# EAGLE design Modul wykonawczy nastawnika (EAGLE 5.09)
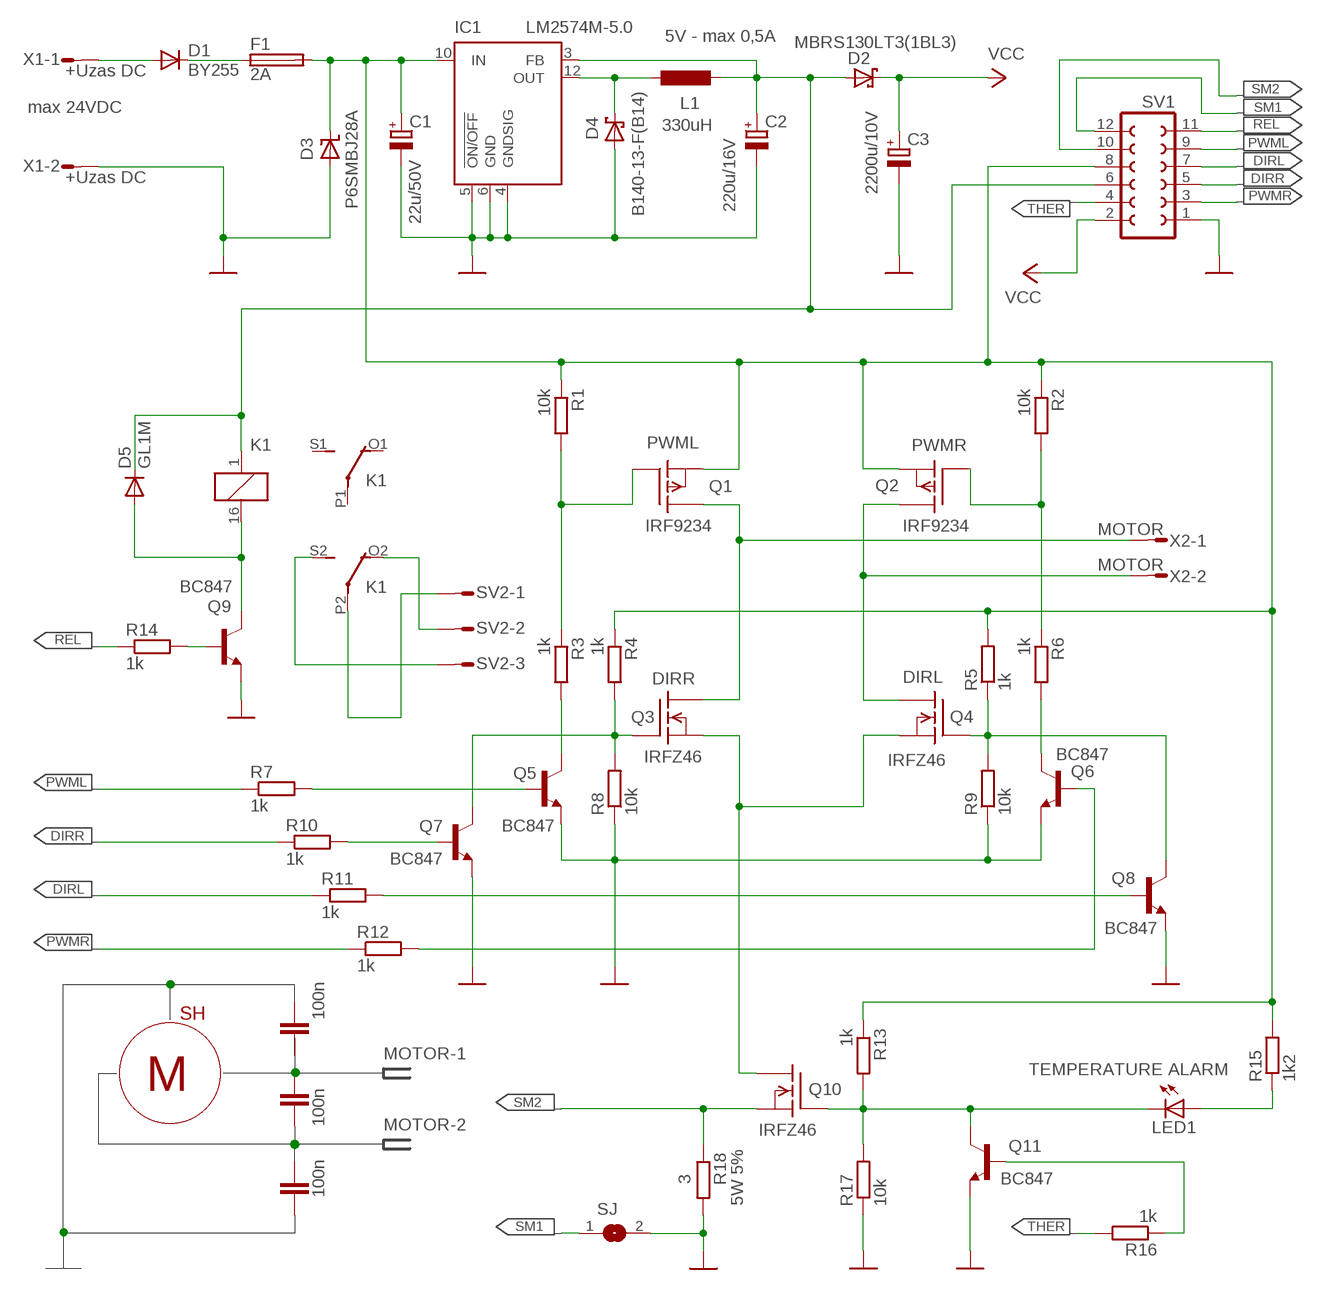
[diagram p0: schematic, sheet 1]

## Parts
C1  22u/50V  CPOL-EUE2.5-6  [E2,5-6]
C2  220u/16V  CPOL-EUE2.5-7  [E2,5-7]
C3  2200u/10V  CPOL-EUE5-10.5  [E5-10,5]
D1  BY255  1N5400  [DO201-15]
D2  MBRS130LT3(1BL3)  MBRS130LT3  [SMB]
D3  P6SMBJ28A  SUPPRESSOR-SMBJ  [SMBJ]
D4  B140-13-F(B14)  MBRS130LT3  [SMB]
D5  GL1M  DIODE-MINIMELF  [MINIMELF]
F1  2A  F6332  [R6332]
IC1  LM2574M-5.0  [SO14W]
K1  351  [351]
L1  330uH  L-EUWE-TPC  [POWER-CHOKE]
LED1  LED3MM  [LED3MM]
Q1  IRF9234  IRF9530  [TO220V]
Q2  IRF9234  IRF9530  [TO220V]
Q3  IRFZ46  BUZ11  [TO220V]
Q4  IRFZ46  BUZ11  [TO220V]
Q5  BC847  BC847BSMD  [SOT23]
Q6  BC847  BC847BSMD  [SOT23]
Q7  BC847  BC847BSMD  [SOT23]
Q8  BC847  BC847BSMD  [SOT23]
Q9  BC847  BC847BSMD  [SOT23]
Q10  IRFZ46  BUZ11  [TO220V]
Q11  BC847  BC847BSMD  [SOT23]
R1  10k  R-EU_M0805  [M0805]
R2  10k  R-EU_M0805  [M0805]
R3  1k  R-EU_M0805  [M0805]
R4  1k  R-EU_M0805  [M0805]
R5  1k  R-EU_M0805  [M0805]
R6  1k  R-EU_M0805  [M0805]
R7  1k  R-EU_M0805  [M0805]
R8  10k  R-EU_M0805  [M0805]
R9  10k  R-EU_M0805  [M0805]
R10  1k  R-EU_M0805  [M0805]
R11  1k  R-EU_M0805  [M0805]
R12  1k  R-EU_M0805  [M0805]
R13  1k  R-EU_M0805  [M0805]
R14  1k  R-EU_M0805  [M0805]
R15  1k2  R-EU_M0805  [M0805]
R16  1k  R-EU_M0805  [M0805]
R17  10k  R-EU_M0805  [M0805]
R18  3  R-EU_0617/22  [0617/22]
SJ  SJ  [SJ]
SV1  FE06-2  [FE06-2]
SV2  S03P  [S03P]
X1  +Uzas DC  S02P  [S02P]
X2  MOTOR  S02P  [S02P]

## Nets
+REL: C2.+ D2.A D5.C IC1.3(FB) K1.1 L1.2 SV1.6
+V: C1.+ D3.C F1.2 IC1.10(IN) Q1.3(S) Q2.3(S) R1.1 R2.1 R4.1 R5.2 R13.1 R15.2 SV1.8
DIRL: R11.1 SV1.7
DIRR: R10.1 SV1.5
GND: C1.- C2.- C3.- D3.A D4.A IC1.4(GNDSIG) IC1.5(!ON/OFF) IC1.6(GND) Q5.2(E) Q6.2(E) Q7.2(E) Q8.2(E) Q9.2(E) Q11.2(E) R8.1 R9.1 R17.1 R18.2 SJ.2 SV1.1 X1.2
N$1: Q3.3(S) Q4.3(S) Q10.2(D)
N$2: LED1.K(C) Q10.1(G) Q11.3(C) R13.2 R17.2
N$3: Q9.1(B) R14.2
N$4: Q5.1(B) R7.2
N$5: K1.P2(3:P) SV2.1
N$6: LED1.A R15.1
N$7: K1.O2(3:O) SV2.2
N$8: Q6.1(B) R12.2
N$9: K1.S2(3:S) SV2.3
N$10: D1.C F1.1
N$11: Q7.1(B) R10.2
N$12: Q11.1(B) R16.1
N$13: Q2.2(D) Q4.2(D) X2.2
N$15: Q8.1(B) R11.2
N$48: Q1.2(D) Q3.2(D) X2.1
N$50: Q1.1(G) R1.2 R3.1
N$51: Q3.1(G) Q7.3(C) R4.2 R8.2
N$52: Q4.1(G) Q8.3(C) R5.1 R9.2
N$53: Q2.1(G) R2.2 R6.1
N$55: Q5.3(C) R3.2
N$57: Q6.3(C) R6.2
N$82: D5.A K1.16 Q9.3(C)
N$89: D1.A X1.1
N$90: D4.C IC1.12(OUT) L1.1
PWML: R7.1 SV1.9
PWMR: R12.1 SV1.3
REL: R14.1 SV1.11
SM1: SJ.1 SV1.12
SM2: Q10.3(S) R18.1 SV1.10
THER: R16.2 SV1.4
VCC: C3.+ D2.C SV1.2
Unconnected: K1.O1(2:O) K1.P1(2:P) K1.S1(2:S)

## Notes on the sheet
- 5V - max 0,5A
- max 24VDC
- PWML | PWMR
- DIRR | DIRL
- SH | 100n
- MOTOR-1
- TEMPERATURE ALARM
- M
- 100n | MOTOR-2
- 100n
- 5W 5%

## Library data of the parts
C1-C3 = rcl:CPOL-EU: POLARIZED CAPACITOR, European symbol
D1 = diode:1N5400: DIODE standard rectifier, 3 A, 50 V (Motorola)
D2 D4 = diode:MBRS130LT3: Schottky Power Rectifier Source: http://www.onsemi.com/pub/Collateral/MBRS130LT3-D.PDF
D3 = diode:SUPPRESSOR-: Suppressor diode
D5 = diode:DIODE-: DIODE
F1 = fuse:F6332
IC1 = linear:LM2574?-*: SIMPLE SWITCHER 0.5A Step-Down Voltage Regulator Source: http://cache.national.com/ds/LM/LM2574.pdf
K1 = relay:351: RELAY 2 x switch, Omron
L1 = rcl:L-EU: INDUCTOR, European symbol
LED1 = led:LED: LED OSRAM: - CHIPLED LG R971, LG N971, LY N971, LG Q971, LY Q971, LO R971, LY R971 LH N974, LH R974 LS Q976, LO Q976, LY Q976 LO Q996 - Hyper CHIPLED LW Q18S LB Q993, LB Q99A, LB R99A - SideLED LS A670, LO A670, LY A670, LG A670, LP A670 LB A673, LV A673, LT A673, LW A673 LH A674 LY A675 LS A676, LA A676, LO A676, LY A676, LW A676 LS A679, LY A679, LG A679 - Hyper Micro SIDELED® LS Y876, LA Y876, LO Y876, LY Y876 LT Y87S - SmartLED LW L88C, LW L88S LB L89C, LB L89S, LG L890 LS L89K, LO L89K, LY L89K LS L896, LA L896, LO L896, LY L896 - TOPLED LS T670, LO T670, LY T670, LG T670, LP T670 LSG T670, LSP T670, LSY T670, LOP T670, LYG T670 LG T671, LOG T671, LSG T671 LB T673, LV T673, LT T673, LW T673 LH T674 LS T676, LA T676, LO T676, LY T676, LB T676, LH T676, LSB T676, LW T676 LB T67C, LV T67C, LT T67C, LS T67K, LO T67K, LY T67K, LW E67C LS E67B, LA E67B, LO E67B, LY E67B, LB E67C, LV E67C, LT E67C LW T67C LS T679, LY T679, LG T679 LS T770, LO T770, LY T770, LG T770, LP T770 LB T773, LV T773, LT T773, LW T773 LH T774 LS E675, LA E675, LY E675, LS T675 LS T776, LA T776, LO T776, LY T776, LB T776 LHGB T686 LT T68C, LB T68C - Hyper Mini TOPLED® LB M676 - Mini TOPLED Santana® LG M470 LS M47K, LO M47K, LY M47K Source: http://www.osram.convergy.de - LUMILED® LXK2-PW12-R00, LXK2-PW12-S00, LXK2-PW14-U00, LXK2-PW14-V00 LXK2-PM12-R00, LXK2-PM12-S00, LXK2-PM14-U00 LXK2-PE12-Q00, LXK2-PE12-R00, LXK2-PE12-S00, LXK2-PE14-T00, LXK2-PE14-U00 LXK2-PB12-K00, LXK2-PB12-L00, LXK2-PB12-M00, LXK2-PB14-N00, LXK2-PB14-P00, LXK2-PB14-Q00 LXK2-PR12-L00, LXK2-PR12-M00, LXK2-PR14-Q00, LXK2-PR14-R00 LXK2-PD12-Q00, LXK2-PD12-R00, LXK2-PD12-S00 LXK2-PH12-R00, LXK2-PH12-S00 LXK2-PL12-P00, LXK2-PL12-Q00, LXK2-PL12-R00 Source: www.luxeon.com
Q1 Q2 = transistor-fet:IRF9530: P-Channel Enhancement MOSFET (HEXFET); -100V; -12A; 0,3Ohm
Q3 Q4 Q10 = transistor-fet:BUZ11: N-Channel Enhancement MOSFET 50V; 30A; 0,040Ohm
Q5-Q9 Q11 = transistor-npn:BC847*: NPN Transistor
R1-R18 = rcl:R-EU_: RESISTOR, European symbol
SJ = jumper:SJ: SMD solder JUMPER
SV1 = con-lsta:FE06-2: FEMALE HEADER
SV2 = con-amp-mt:S03P: AMP MT CONNECTOR
X1 X2 = con-amp-mt:S02P: AMP MT CONNECTOR

## Board
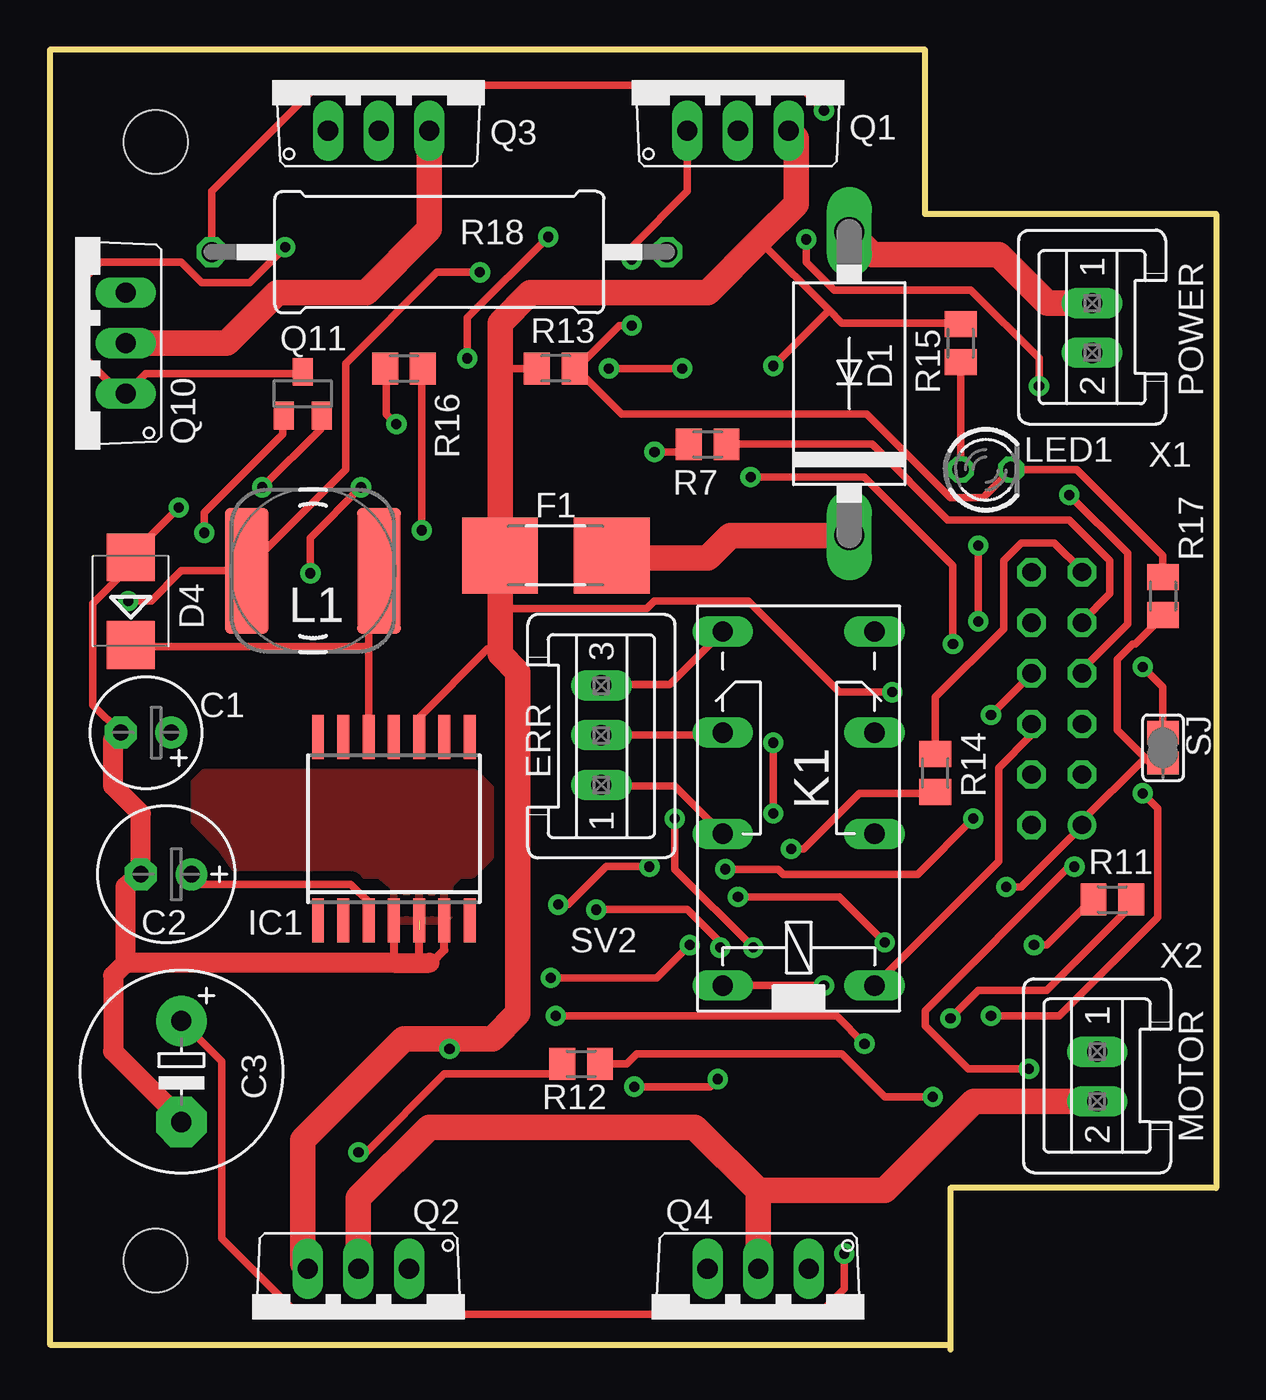
[diagram p1: board, top side]
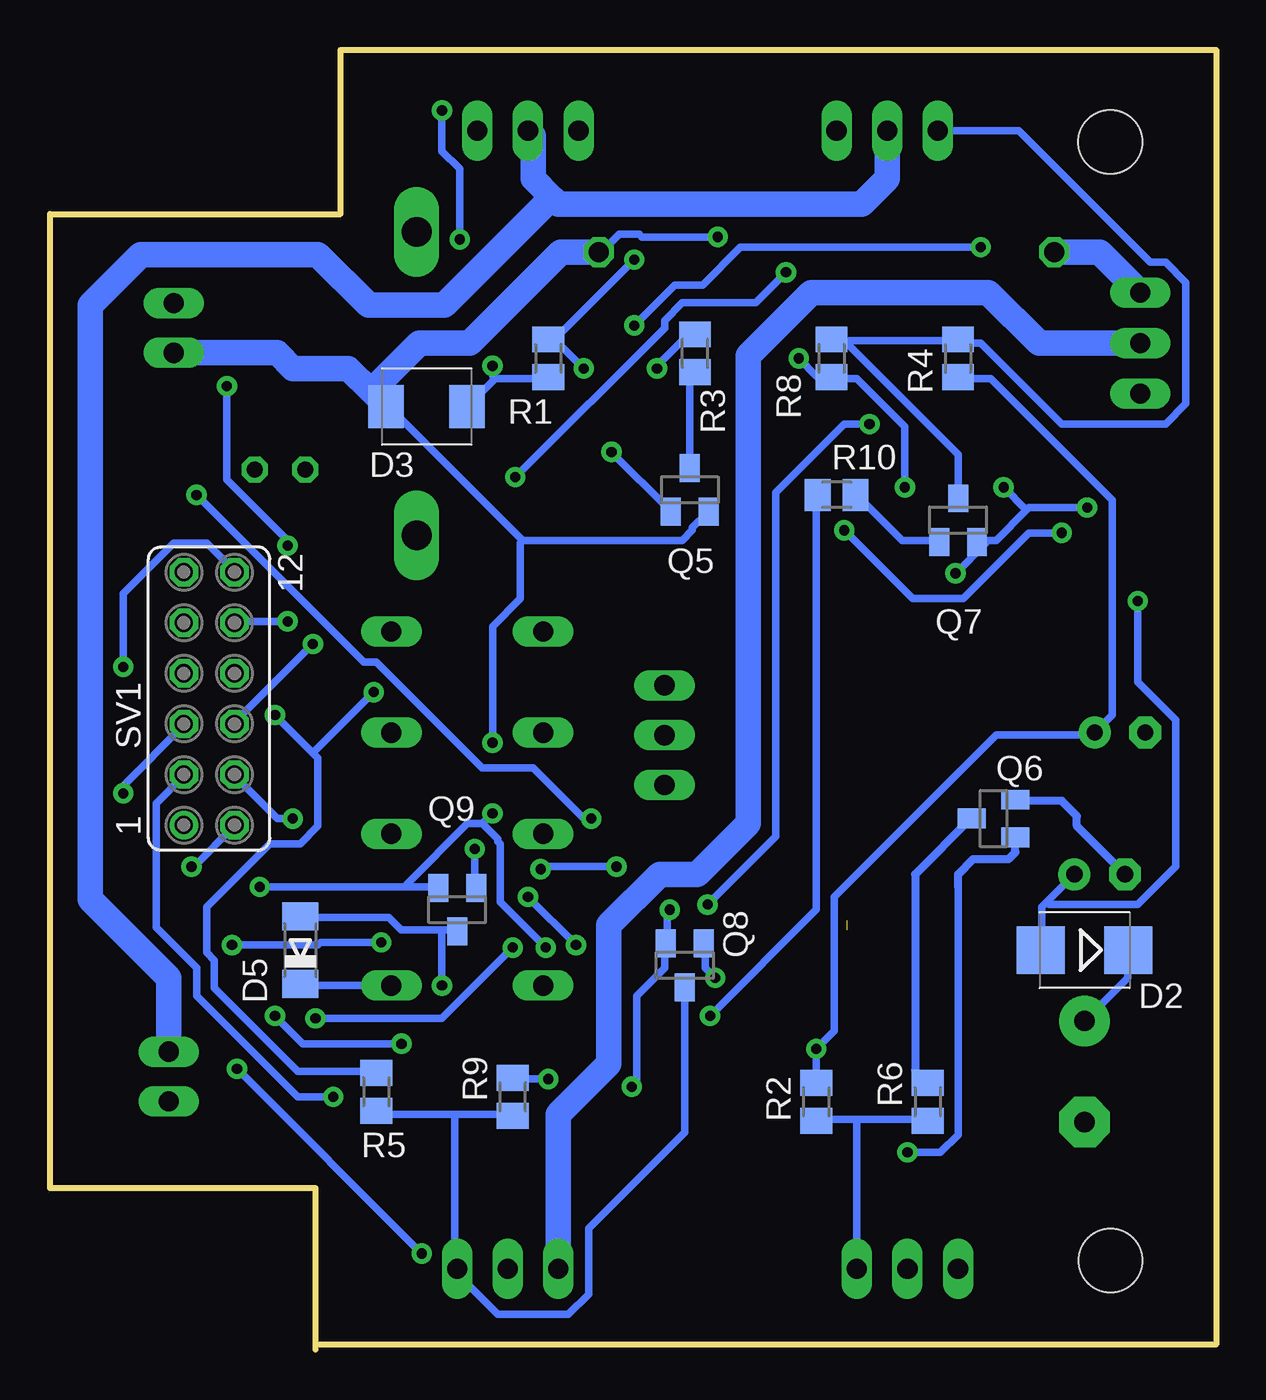
[diagram p2: board, bottom side, seen from below]

Size 58.55 x 65.28 mm. Coordinates in mm from the lower left corner, seen from the top.
Outline: 45.21,0.25 45.21,8.13 58.55,8.13 58.55,57.02 43.94,57.02 43.94,65.28 0,65.28 0,0.25 45.21,0.25
Outline: 45.21,0.25 45.21,0
Copper layers (1*16): Top 0.035mm / dielectric 1.55mm / Bottom 0.035mm
Design rules "pwr": minimum track width 15mil, minimum drill 20mil, track to track 18mil, track to pad 18mil, pad to pad 8mil, via to via 18mil, smd to smd 8mil, copper to edge 40mil, drill to drill 20mil, minimum pad ring 10mil, minimum via ring 8mil, stop-mask expansion 4mil, vias tented up to drill 0mil, thermal gap 10mil
Holes 3.2 mm at 5.31,60.65 5.3,4.48

### Footprints (pad centres in the part's own frame; a part is rotated, then mirrored left to right if it is on the bottom)
E2,5-6 = drill 0.813 pad 1.6 round: + -1.27,0 | drill 0.813 pad 1.6 octagon: - 1.27,0
E2,5-7 = drill 0.813 pad 1.6 round: + -1.27,0 | drill 0.813 pad 1.6 octagon: - 1.27,0
E5-10,5 = drill 1.016 pad 2.54 round: + -2.54,0 | drill 1.016 pad 2.54 octagon: - 2.54,0
DO201-15 = drill 1.499 long: A 7.62,0; C -7.62,0
SMB = smd 2.4 x 2.4: A 2.2,0; C -2.2,0
SMBJ = smd 1.78 x 2.16: A 2.04,0; C -2.03,0
MINIMELF = smd 1.4 x 1.8: A 1.7,0; C -1.7,0
R6332 = smd 3.81 x 3.81: 1 -2.8,0; 2 2.8,0
SO14W = smd 0.6 x 2.2: 1 -3.81,-4.6; 2 -2.54,-4.6; 3 -1.27,-4.6; 4 0,-4.6; 5 1.27,-4.6; 6 2.54,-4.6; 7 3.81,-4.6; 8 3.81,4.6; 9 2.54,4.6; 10 1.27,4.6; 11 0,4.6; 12 -1.27,4.6; 13 -2.54,4.6; 14 -3.81,4.6
351 = drill 1.016 long: 1 -3.81,-3.81; 16 -3.81,3.81; O1 8.89,-3.81; O2 8.89,3.81; P1 3.81,-3.81; P2 3.81,3.81; S1 13.97,-3.81; S2 13.97,3.81
POWER-CHOKE = smd 6.3 x 2.2: 1 0,3.32; 2 0,-3.32
LED3MM = drill 0.813 octagon: A -1.27,0; K 1.27,0
TO220V = drill 1.016 long: 1 -2.54,-2.54; 2 0,-2.54; 3 2.54,-2.54
SOT23 = smd 1 x 1.4: 1 -0.95,-1.1; 2 0.95,-1.1; 3 0,1.1
M0805 = smd 1.3 x 1.6: 1 -0.95,0; 2 0.95,0
0617/22 = drill 1.016 octagon: 1 -11.43,0; 2 11.43,0
SJ = smd 1.168 x 1.6: 1 -0.762,0; 2 0.762,0
FE06-2 = drill 0.914 round: 1 -6.35,1.27 | drill 0.914 octagon: 2 -6.35,-1.27; 3 -3.81,1.27; 4 -3.81,-1.27; 5 -1.27,1.27; 6 -1.27,-1.27; 7 1.27,1.27; 8 1.27,-1.27; 9 3.81,1.27; 10 3.81,-1.27; 11 6.35,1.27; 12 6.35,-1.27
S03P = drill 1.016 long: 1 2.5,0; 2 0,0; 3 -2.5,0
S02P = drill 1.016 long: 1 1.25,0; 2 -1.25,0

### Placement (x,y rotation side)
C1  4.83,30.99 180 top
C2  5.84,23.88 180 top
C3  6.6,13.97 270 top
D1  40.13,48.51 90 top
D2  6.6,20.07 180 bottom
D3  39.62,47.37 180 bottom
D4  4.06,37.59 90 top
D5  45.97,20.07 90 bottom
F1  25.4,39.88 180 top
IC1  17.27,26.16 0 top
K1  37.59,22.1 90 top
L1  13.21,39.12 270 top
LED1  46.99,44.2 0 top
Q1  34.54,63.75 0 top
Q2  15.49,1.52 180 top
Q3  16.51,63.75 0 top
Q4  35.56,1.52 180 top
Q5  26.42,43.18 0 bottom
Q6  11.18,26.67 90 bottom
Q7  12.95,41.66 0 bottom
Q8  26.67,19.3 180 bottom
Q9  38.1,22.1 180 bottom
Q10  1.27,50.55 90 top
Q11  12.7,48.01 0 top
R1  33.53,49.78 90 bottom
R2  20.07,12.45 270 bottom
R3  26.16,50.04 270 bottom
R4  12.95,49.78 90 bottom
R5  42.16,12.95 90 bottom
R6  14.48,12.45 90 bottom
R7  33.02,45.47 180 top
R8  19.3,49.78 90 bottom
R9  35.31,12.7 270 bottom
R10  19.05,42.93 0 bottom
R11  53.34,22.61 180 top
R12  26.67,14.35 180 top
R13  25.4,49.28 0 top
R14  44.45,28.96 270 top
R15  45.72,50.55 90 top
R16  17.78,49.28 180 top
R17  55.88,37.85 90 top
R18  19.56,55.12 0 top
SJ  55.88,30.23 270 top
SV1  50.55,32.7 90 bottom
SV2  27.69,30.86 270 top
X1  52.32,51.31 90 top
X2  52.58,13.72 90 top

### Tracks (layer width: path | path; a pad name or v marks a point on that pad's centre or on a via)
+REL  (via drill 0.51)
  Top 0.381: K1.1 47.62,24.51 47.62,29.21 49.28,30.86 SV1.6 | C2.+ 7.62,23.37 15.11,23.37 16,22.48 IC1.3 | v3.94,37.59 5.08,37.59 6.6,39.12 L1.2 9.91,39.24 14.86,44.2 14.86,49.53 19.43,54.1 v21.59,54.1 | v45.34,35.43 45.34,39.37 40.89,43.82 v35.18,43.82
  Bottom 0.381: K1.1 45.97,18.29 D5.C | C2.+ 8.51,22.48 | 8.51,22.48 8.76,22.23 8.76,20.07 D2.A | v3.94,37.59 3.94,33.53 2.03,31.62 2.03,24.26 3.94,22.35 8.38,22.35 8.51,22.48 | v45.34,35.43 49.28,31.5 SV1.6 | v35.18,43.82 27.69,51.31 27.69,51.69 26.8,52.58 23.11,52.58 v21.59,54.1
+V  (via drill 0.51)
  Top 0.381: v47.24,31.88 49.28,33.91 SV1.8 | v20.07,15.11 20.07,15.62 | 22.6,49.28 R13.1 | 39.12,52.2 39.75,51.56 45.72,51.56 R15.2 | 35.62,55.69 39.12,52.2 | IC1.10 18.54,31.75 21.97,35.18 22.6,35.18 | 39.12,52.2 v36.32,49.4 | v42.29,33.02 39.62,33.02 35.05,37.59 30.35,37.59 29.97,37.21 22.6,37.21
  Top 1.27: Q1.3 37.47,60.83 37.47,57.53 35.62,55.69 33.02,53.09 24.13,53.09 22.6,51.56 22.6,49.28 F1.2 22.6,37.21 22.6,35.18 22.6,34.93 23.5,34.04 23.5,16.89 22.22,15.62 20.07,15.62 17.78,15.62 12.7,10.54 12.7,4.32 Q2.3
  Bottom 0.381: 45.34,29.97 v47.24,31.88 | 45.34,29.97 45.09,29.72 45.09,26.29 45.97,25.4 47.5,25.4 50.67,22.23 50.67,19.94 50.29,19.56 50.29,18.16 46.1,13.97 42.16,13.97 R5.2 | R4.1 12.95,48.77 11.3,48.77 5.21,42.67 5.21,31.88 C1.+ 6.22,30.86 11.05,30.86 19.18,22.73 19.18,16 v20.07,15.11 R2.1 | 36.2,48.77 33.53,48.77 R1.1 | 36.2,48.77 D3.C | v36.32,49.4 36.32,48.9 36.2,48.77 | v42.29,33.02 45.34,29.97
DIRL  (via drill 0.51)
  Top 0.381: v45.21,16.64 46.61,18.03 50.04,18.03 54.23,22.23 54.23,22.61 R11.1 | v35.31,20.19 31.37,24.13 v31.37,26.67 | v51.18,42.93 54.1,40.01 54.1,36.45 51.82,34.16 SV1.7
  Bottom 0.381: v45.21,16.64 38.86,16.64 v35.31,20.19 | v31.37,26.67 31.75,26.67 34.29,29.21 36.83,29.21 42.16,34.54 42.8,34.54 v51.18,42.93
DIRR  (via drill 0.51)
  Top 0.381: v25.4,16.76 39.5,16.76 v40.89,15.37 | v47.24,16.76 50.67,16.76 55.63,21.72 55.63,27.18 v54.86,27.94
  Bottom 0.381: v25.4,16.76 20.07,22.1 20.07,42.93 R10.1 | v40.89,15.37 45.85,15.37 v47.24,16.76 | v54.86,27.94 54.86,28.32 51.82,31.37 SV1.5
GND  (via drill 0.51)  (1 unrouted)
  Top 0.381: v6.48,42.29 4.06,39.88 D4.A 4.06,39.37 2.16,37.47 2.16,32.39 C1.- | v10.67,43.31 13.59,46.23 13.59,46.86 Q11.2 | v15.62,43.31 13.08,40.77 v13.08,38.99 | IC1.4 17.15,21.46 | v29.34,13.21 33.15,13.21 v33.53,13.59 | 54.99,29.72 55.25,29.46 SJ.2 | 54.99,29.72 53.59,31.12 53.59,34.67 54.36,35.43 54.48,35.43 55.88,36.83 R17.1 | v48.01,23.24 48.77,23.24 51.82,26.29 SV1.1 51.69,26.42 54.99,29.72 | v27.43,22.1 32,22.1 33.66,20.45 v33.66,20.19 | v36.32,30.48 v36.32,26.92 | v20.95,49.78 20.95,51.82 v25.02,55.88
  Top 0.406: 19.05,19.43 19.18,19.43 19.81,20.07 IC1.6 | 17.27,21.08 17.27,19.43 | 18.54,19.3 18.54,21.08
  Top 1.016: C3.- 6.6,11.56 3.18,14.99 3.18,18.8 3.81,19.43 | 3.81,19.43 17.27,19.43 19.05,19.43 | 3.81,19.43 3.81,23.24 4.45,23.88 C2.- 4.57,26.92 3.18,28.32 3.18,30.61 C1.-
  Bottom 0.381: 9.52,42.16 9.4,42.29 v6.48,42.29 | 9.52,42.16 11.05,40.64 11.94,40.64 Q7.2 11.56,40.51 v13.08,38.99 | 9.52,42.16 v10.67,43.31 | v15.62,43.31 15.62,46.36 18.03,48.77 19.3,48.77 R8.1 19.43,48.9 20.07,48.9 v20.95,49.78 | 34.8,40.64 26.8,40.64 26.29,41.15 26.29,41.28 25.53,42.04 Q5.2 | 34.8,40.64 41.15,46.99 D3.A | v29.34,13.21 29.08,13.46 29.08,17.78 27.69,19.18 27.69,20.32 Q8.2 27.56,20.57 27.56,21.97 v27.43,22.1 | v33.53,13.59 35.31,13.59 R9.1 | 40.64,23.24 v48.01,23.24 | 40.64,23.24 39.12,23.24 Q9.2 | v33.66,20.19 35.94,22.48 35.94,25.4 36.07,25.53 36.07,25.65 36.83,26.42 | 36.83,26.42 37.59,26.42 40.64,23.37 40.64,23.24 | v36.32,30.48 36.32,36.32 34.92,37.72 34.92,40.51 34.8,40.64 | v36.32,26.92 36.83,26.42 | v25.02,55.88 28.83,55.88 28.96,56.01 29.97,56.01 30.48,55.5 R18.2
  Bottom 0.406: C2.- 6.98,26.29 6.98,26.8 7.75,27.56 10.02,27.56 Q6.2
  Bottom 1.27: X1.2 47.14,50.06 46.36,49.28 43.57,49.28 42.42,48.13 | 42.42,48.13 D3.A | R18.2 32.89,55.12 37.47,50.55 40,50.55 42.42,48.13
  pour Top: 7.24,26.54 8.64,25.15 9.52,23.88 16.51,23.88 17.27,23.24 17.27,21.59 17.53,21.34 19.56,21.34 20.07,21.84 20.07,23.37 20.57,23.88 21.21,23.88 22.1,24.77 22.1,28.19 21.34,28.96 7.75,28.96 7.24,28.45
N$1
  Top 1.27: Q10.2 8.89,50.55 11.43,53.09 15.88,53.09 19.05,56.26 Q3.3
  Bottom 1.27: Q4.3 33.02,11.81 30.48,14.35 30.48,21.34 27.94,23.88 26.03,23.88 23.5,26.42 23.5,49.91 20.32,53.09 11.43,53.09 8.89,50.55 Q10.2
N$2  (via drill 0.51)
  Top 0.381: Q11.3 12.7,49.02 4.83,49.02 Q10.1 3.68,48.13 3.43,48.13 1.52,50.04 1.52,53.59 2.54,54.61 6.6,54.61 7.62,53.59 10.03,53.59 v11.81,55.37 | R17.2 55.88,39.88 51.56,44.2 LED1.K 46.86,42.8 45.21,42.8 41.02,46.99 28.7,46.99 26.42,49.28 R13.2 26.54,49.4 28.58,51.44 v29.21,51.44
  Bottom 0.381: v11.81,55.37 23.88,55.37 25.78,53.47 27.18,53.47 v29.21,51.44
N$3  (via drill 0.51)
  Top 0.381: v37.21,25.15 37.85,25.15 40.64,27.94 44.45,27.94 R14.2
  Bottom 0.381: v37.21,25.15 37.21,23.24 Q9.1
N$4  (via drill 0.51)
  Top 0.381: v30.35,45.09 31.62,45.09 32,45.47 R7.2
  Bottom 0.381: v30.35,45.09 27.43,42.16 Q5.1
N$5
  Top 0.381: K1.P2 31.37,28.32 27.69,28.32 SV2.1
N$6
  Top 0.381: LED1.A R15.1
N$7
  Top 0.381: SV2.2 33.66,30.86 K1.O2
N$8  (via drill 0.51)
  Top 0.381: v15.49,9.91 15.88,9.91 19.81,13.84 25.15,13.84 25.65,14.35 R12.2
  Bottom 0.381: 12.95,23.24 12.95,10.8 13.84,9.91 v15.49,9.91
  Bottom 0.406: Q6.1 10.08,24.98 10.41,24.64 12.19,24.64 12.95,23.88 12.95,23.24
N$9
  Top 0.381: K1.S2 31.11,33.4 27.69,33.4 SV2.3
N$10
  Top 1.27: D1.C 34.16,40.89 33.02,39.75 28.33,39.75 F1.1
N$11
  Bottom 0.381: Q7.1 13.97,40.64 15.75,40.64 18.03,42.93 R10.2
N$12  (via drill 0.51)
  Top 0.381: v7.75,41.02 7.75,42.04 11.68,45.97 11.68,46.86 Q11.1 | v18.67,41.15 18.67,49.28 R16.1
  Bottom 0.381: v7.75,41.02 9.4,41.02 12.7,37.72 15.24,37.72 v18.67,41.15
N$13
  Top 1.27: Q2.2 15.49,7.62 19.05,11.18 32.39,11.18 35.56,8 | Q4.2 35.56,8 | X2.2 46.38,12.47 41.91,8 35.56,8
N$15  (via drill 0.51)
  Top 0.381: v25.15,18.67 30.48,18.67 v32.13,20.32 | v34.54,22.73 39.62,22.73 v41.91,20.45 | v49.4,20.32 50.04,20.32 52.32,22.61 R11.2
  Bottom 0.381: v25.15,18.67 25.65,19.18 25.65,20.32 Q8.1 | v32.13,20.32 v34.54,22.73 | v41.91,20.45 44.96,20.45 45.09,20.32 v49.4,20.32
N$48
  Bottom 1.27: Q3.2 16.51,58.8 17.78,57.53 33.02,57.53 33.34,57.85 | 33.34,57.85 34.29,58.8 34.29,60.96 Q1.2 | X2.1 52.58,18.67 56.52,22.61 56.52,52.45 53.97,54.99 45.09,54.99 42.55,52.45 38.73,52.45 33.34,57.85
N$50  (via drill 0.51)
  Top 0.381: v28.07,49.28 v31.75,49.28 | Q1.1 32,58.17 29.21,55.37 v29.21,54.74
  Bottom 0.381: v28.07,49.28 28.07,49.4 26.54,50.93 26.16,50.93 R3.1 | v31.75,49.28 33.15,50.67 33.53,50.67 R1.2 33.15,50.8 v29.21,54.74
N$51
  Bottom 0.381: 18.54,50.55 18.67,50.67 19.3,50.67 R8.2 | 18.54,50.55 12.95,44.96 Q7.3 | 18.54,50.55 18.42,50.67 12.95,50.67 R4.2 12.83,50.55 11.81,50.55 7.75,46.48 2.54,46.48 1.52,47.5 1.52,53.59 2.54,54.61 3.3,54.61 9.91,61.21 Q3.1
N$52
  Bottom 0.381: 38.23,11.81 42.04,11.81 42.16,11.94 R5.1 | 38.23,11.81 35.31,11.81 R9.2 | Q8.3 26.67,10.92 31.5,6.1 31.5,2.79 32.51,1.78 36.07,1.78 38.1,3.81 Q4.1 38.23,4.19 38.23,11.81
N$53
  Bottom 0.381: 18.03,11.56 20.07,11.56 R2.2 | 18.03,11.56 14.48,11.56 R6.1 | 18.03,11.56 Q2.1
N$55
  Bottom 0.381: Q5.3 26.42,48.77 26.16,49.02 R3.2
N$57
  Bottom 0.381: 14.22,13.72 14.48,13.46 R6.2
  Bottom 0.406: Q6.3 12.32,26.67 15.11,23.88 15.11,14.03 R6.2
N$82  (via drill 0.51)
  Top 0.381: K1.16 v38.86,18.29
  Bottom 0.381: 38.86,21.08 40.89,21.08 41.53,21.72 45.97,21.72 D5.A | 38.86,21.08 38.1,21.08 Q9.3 | v38.86,18.29 38.86,21.08
N$89
  Top 1.27: X1.1 50.06,52.56 47.62,54.99 41.28,54.99 D1.A
N$90
  Top 0.381: 16,35.31 16,38.61 16.51,39.12 L1.1 | 16,35.31 IC1.12 | D4.C 4.06,35.31 16,35.31
PWML
  Top 0.381: R7.1 41.28,45.47 45.09,41.66 51.18,41.66 53.21,39.62 53.21,37.97 51.82,36.58 SV1.9
PWMR  (via drill 0.51)
  Top 0.381: v44.32,12.7 41.91,12.7 39.75,14.86 29.46,14.86 28.96,14.35 R12.1
  Bottom 0.381: v44.32,12.7 46.1,12.7 51.18,17.78 51.18,19.18 53.21,21.21 53.21,27.43 51.82,28.83 SV1.3
REL
  Top 0.381: R14.1 44.45,32.77 47.88,36.2 47.88,39.62 48.77,40.51 50.42,40.51 51.82,39.12 SV1.11
SM1  (via drill 0.51)
  Top 0.381: SJ.1 55.88,33.27 v54.86,34.29
  Bottom 0.381: v54.86,34.29 54.86,37.97 52.32,40.51 50.67,40.51 49.28,39.12 SV1.12
SM2  (via drill 0.51)
  Top 0.381: v46.61,40.39 v46.61,36.58 | v49.66,48.39 49.66,49.78 46.23,53.21 39.37,53.21 37.97,54.61 v37.97,55.75 | v38.86,62.23 37.59,63.5 13.46,63.5 8.13,58.17 R18.1
  Bottom 0.381: v46.61,36.58 49.28,36.58 SV1.10 | v46.61,40.39 46.61,40.64 49.66,43.69 v49.66,48.39 | v37.97,55.75 37.97,59.31 38.86,60.2 v38.86,62.23
  Bottom 1.27: R18.1 5.84,55.12 Q10.3
THER  (via drill 0.51)
  Top 0.381: v17.4,46.48 16.89,46.99 16.89,49.28 R16.2 | v25.53,22.35 26.03,22.35 27.94,24.26 v30.1,24.26 | v33.91,24.13 36.58,24.13 36.83,23.88 43.56,23.88 v46.36,26.67
  Bottom 0.381: v17.4,46.48 18.67,46.48 22.1,43.05 22.1,25.78 v25.53,22.35 | v30.1,24.26 33.78,24.26 v33.91,24.13 | v46.36,26.67 47.12,26.67 49.28,28.83 SV1.4
VCC  (via drill 0.51)
  Top 0.381: v51.44,24.26 51.18,24.26 43.94,17.02 43.94,16.26 46.1,14.1 v49.15,14.1 | v39.88,4.83 39.88,3.05 38.61,1.78 12.45,1.78 8.64,5.59 8.64,14.48 C3.+
  Bottom 0.381: C3.+ 4.45,18.67 4.45,20.07 D2.C | v51.44,24.26 51.31,24.26 49.28,26.29 SV1.2 | v39.88,4.83 v49.15,14.1

### Text on the board
tNames: POWER | ERR | MOTOR